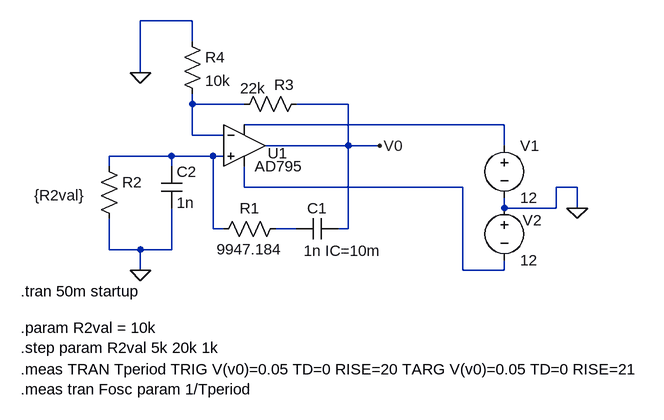
[diagram p0: schematic HomeworkProblem1.asc]
HomeworkProblem1.asc, the LTspice schematic file:
Version 4
SHEET 1 1172 680
WIRE 320 -80 240 -80
WIRE 320 -48 320 -80
WIRE 240 0 240 -80
WIRE 320 48 320 32
WIRE 400 48 320 48
WIRE 560 48 480 48
WIRE 800 80 400 80
WIRE 320 96 320 48
WIRE 368 96 320 96
WIRE 560 112 560 48
WIRE 560 112 432 112
WIRE 608 112 560 112
WIRE 800 112 800 80
WIRE 288 128 192 128
WIRE 352 128 288 128
WIRE 368 128 352 128
WIRE 192 144 192 128
WIRE 288 144 288 128
WIRE 400 176 400 144
WIRE 736 176 400 176
WIRE 912 176 880 176
WIRE 800 208 800 192
WIRE 880 208 880 176
WIRE 880 208 800 208
WIRE 912 208 912 176
WIRE 352 240 352 128
WIRE 368 240 352 240
WIRE 480 240 448 240
WIRE 560 240 560 112
WIRE 560 240 544 240
WIRE 192 272 192 224
WIRE 240 272 192 272
WIRE 288 272 288 208
WIRE 288 272 240 272
WIRE 240 304 240 272
WIRE 736 304 736 176
WIRE 800 304 800 288
WIRE 800 304 736 304
FLAG 240 304 0
FLAG 240 0 0
FLAG 608 112 V0
FLAG 912 208 0
SYMBOL OpAmps\\AD795 400 48 R0
WINDOW 0 36 76 Left 2
SYMATTR InstName U1
SYMBOL res 176 128 R0
WINDOW 3 -99 60 Left 2
SYMATTR Value {R2val}
SYMATTR InstName R2
SYMBOL cap 272 144 R0
SYMATTR InstName C2
SYMATTR Value 1n
SYMBOL res 464 224 R90
WINDOW 0 0 56 VBottom 2
WINDOW 3 32 56 VTop 2
SYMATTR InstName R1
SYMATTR Value 9947.184
SYMBOL cap 544 224 R90
WINDOW 0 0 32 VBottom 2
WINDOW 3 34 -7 VTop 2
SYMATTR InstName C1
SYMATTR Value 1n IC=10m
SYMBOL res 304 -64 R0
SYMATTR InstName R4
SYMATTR Value 10k
SYMBOL res 496 32 R90
WINDOW 0 2 35 VBottom 2
WINDOW 3 -24 83 VTop 2
SYMATTR InstName R3
SYMATTR Value 22k
SYMBOL voltage 800 96 R0
WINDOW 123 0 0 Left 0
WINDOW 39 0 0 Left 0
SYMATTR InstName V1
SYMATTR Value 12
SYMBOL voltage 800 192 R0
WINDOW 0 28 35 Left 2
WINDOW 123 0 0 Left 0
WINDOW 39 0 0 Left 0
SYMATTR InstName V2
SYMATTR Value 12
TEXT 56 336 Left 2 !.tran 50m startup
TEXT 56 392 Left 2 !.param R2val = 10k\n.step param R2val 5k 20k 1k
TEXT 56 456 Left 2 !.meas TRAN Tperiod TRIG V(v0)=0.05 TD=0 RISE=20 TARG V(v0)=0.05 TD=0 RISE=21\n.meas tran Fosc param 1/Tperiod

The netlist it stands for:
* HomeworkProblem1.asc
XU1 N003 N001 N002 N004 V0 AD795  ; pins In+ In- V+ V- OUT
R2 N003 0 {R2val}
C2 N003 0 1n
R1 N005 N003 9947.184
C1 V0 N005 1n IC=10m
R4 0 N001 10k
R3 V0 N001 22k
V1 N002 0 12
V2 0 N004 12
.tran 50m startup
.param R2val = 10k
.step param R2val 5k 20k 1k
.meas TRAN Tperiod TRIG V(v0)=0.05 TD=0 RISE=20 TARG V(v0)=0.05 TD=0 RISE=21
.meas tran Fosc param 1/Tperiod
.lib ADI1.lib
.backanno
.end